# Altium schematic sheet utils.SchDoc
size A4
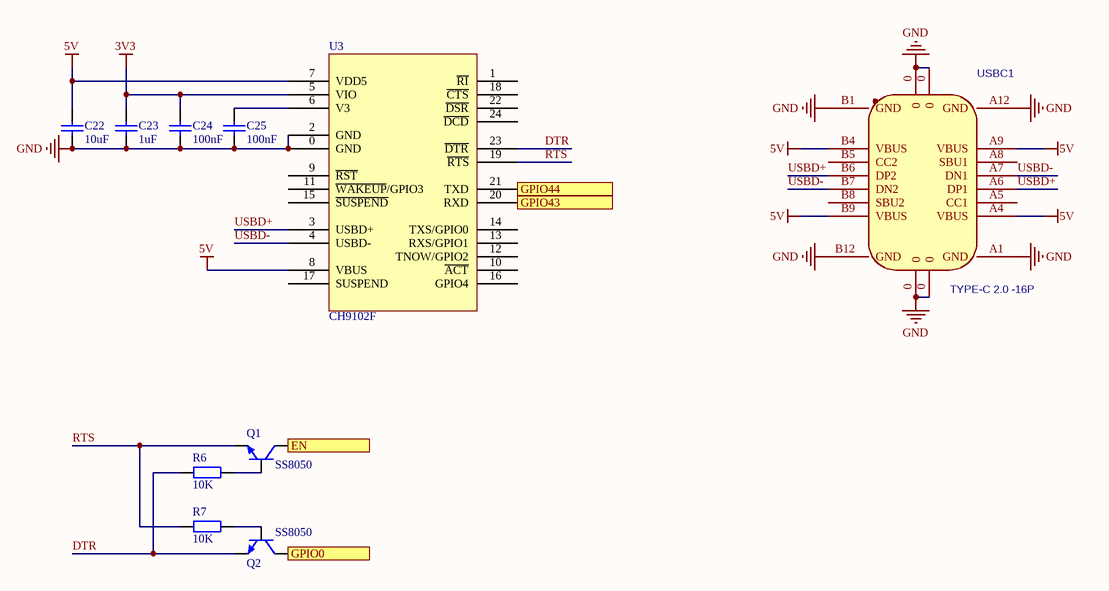
[diagram p0: utils.SchDoc]

## Parts
C22  10uF  [C 0603_L]
C23  1uF  [C 0603_L]
C24  100nF  [C 0603_L]
C25  100nF  [C 0603_L]
Q1  SS8050  [SOT23-3N]
Q2  SS8050  [SOT23-3N]
R6  10K  [R 0603_L]
R7  10K  [R 0603_L]
U3  CH9102F  [QFN24]
USBC1  TYPE-C 2.0 -16P  [USB-C-SMD_TYPE-C-USB-5]

## Ports
EN, GPIO0, GPIO43, GPIO44

## Nets
3V3: C23.2 C24.2 U3.5(VIO)
5V: C22.2 U3.7(VDD5) U3.8(VBUS) USBC1.A4(VBUS) USBC1.A9(VBUS) USBC1.B4(VBUS) USBC1.B9(VBUS)
GND: C22.1 C23.1 C24.1 C25.1 U3.0(GND) U3.2(GND) USBC1.0 USBC1.A1(GND) USBC1.A12(GND) USBC1.B1(GND) USBC1.B12(GND)
DTR: Q2.2(E) R6.1 U3.23(~{DTR})
EN: Q1.3(C) ; port EN
GPIO0: Q2.3(C) ; port GPIO0
GPIO43: U3.20(RXD) ; port GPIO43
GPIO44: U3.21(TXD) ; port GPIO44
RTS: Q1.2(E) R7.1 U3.19(~{RTS})
USBD+: U3.3(USBD+) USBC1.A6(DP1) USBC1.B6(DP2)
USBD-: U3.4(USBD-) USBC1.A7(DN1) USBC1.B7(DN2)
NetC25_2: C25.2 U3.6(V3)
NetQ1_1: Q1.1(B) R6.2
NetQ2_1: Q2.1(B) R7.2

Not connected (* = marked no-connect by the designer): U3 1(~{RI}) 9(~{RST}) 10(~{ACT}) 11(~{WAKEUP}/GPIO3) 12(TNOW/GPIO2) 13(RXS/GPIO1) 14(TXS/GPIO0) 15(~{SUSPEND}) 16(GPIO4) 17(SUSPEND) 18(~{CTS}) 22(~{DSR}) 24(~{DCD}); USBC1 A5(CC1) A8(SBU1) B5(CC2) B8(SBU2)

## Library data of the parts
C22-C25 = C: 贴片电容; BOM名称: 无极性贴片电容; 优秀评价可免费更新: 联系淘宝ID：黄晶宝石，获取更新版封装库; 本封装库来自淘宝卖家 ID：黄晶宝石: 其他店铺购入均为盗版，请立即申请退款; 联系卖家，免费查找封装: 唯一出售店铺网址https://shop463601444.taobao.com
Q1 Q2 = 8050-SMD: 高频放大-NPN型; 属性: 40V 1.5A 1W 100MHZ; 卖家免费技术支持，联系售后: 唯一出售店铺网址https://shop463601444.taobao.com; 封装库来自淘宝卖家 ID：黄晶宝石: 其他店铺购入均为假冒，请立即申请退款，本店奖励2~5元现金; BOM名称: 高频放大-NPN型; 卖家免费查找封装，联系售后: 唯一出售店铺网址https://shop463601444.taobao.com
R6 R7 = R: 贴片电阻; 优秀评价可免费更新: 联系淘宝ID：黄晶宝石，获取更新版封装库; 本封装库来自淘宝卖家 ID：黄晶宝石: 其他店铺购入均为盗版，请立即申请退款; 联系卖家，免费查找封装: 唯一出售店铺网址https://shop463601444.taobao.com; BOM名称: 贴片电阻
U3 = CH9102F: QFN24 CH9102 CP2102替代
USBC1 = USB2.0 Type-C 16Pin母座: USB2.0 Type-C 母座 16Pin; 卖家免费技术支持，联系售后: 唯一出售店铺网址https://shop463601444.taobao.com; 封装库来自淘宝卖家 ID：黄晶宝石: 其他店铺购入均为盗版假冒封装库，请立即申请退款，本店3~10元现金奖励; 卖家免费查找封装，联系售后: 唯一出售店铺网址https://shop463601444.taobao.com